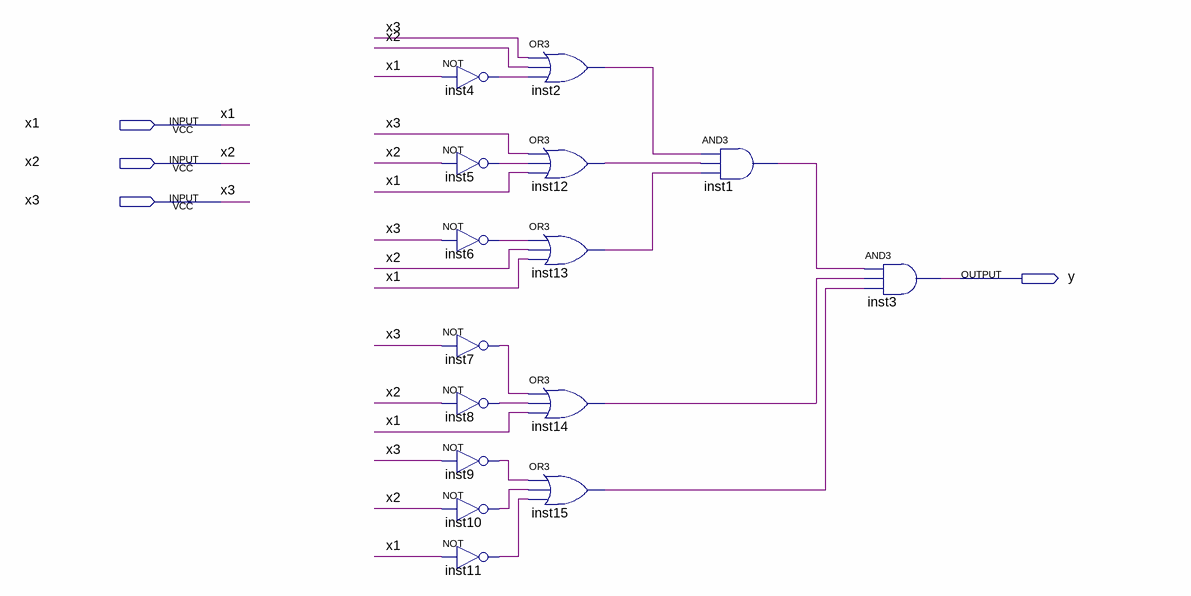
[diagram p0: schematic sheet]
// Quartus schematic block2.bdf as structural Verilog: 15 symbols, 4 pins
module block2 (
  input  x1,
  input  x2,
  input  x3,
  output y
);

  wire inst1_out, inst2_out, inst4_out, inst5_out, inst6_out, inst7_out, inst8_out, inst9_out, inst10_out,
       inst11_out, inst12_out, inst13_out, inst14_out, inst15_out;

  not inst4 (inst4_out, x1);
  not inst5 (inst5_out, x2);
  not inst6 (inst6_out, x3);
  not inst7 (inst7_out, x3);
  not inst8 (inst8_out, x2);
  not inst9 (inst9_out, x3);
  not inst10 (inst10_out, x2);
  not inst11 (inst11_out, x1);
  or inst2 (inst2_out, x3, x2, inst4_out);
  or inst12 (inst12_out, x3, inst5_out, x1);
  or inst13 (inst13_out, inst6_out, x2, x1);
  or inst14 (inst14_out, inst7_out, inst8_out, x1);
  or inst15 (inst15_out, inst9_out, inst10_out, inst11_out);
  and inst1 (inst1_out, inst2_out, inst12_out, inst13_out);
  and inst3 (y, inst1_out, inst14_out, inst15_out);
endmodule
